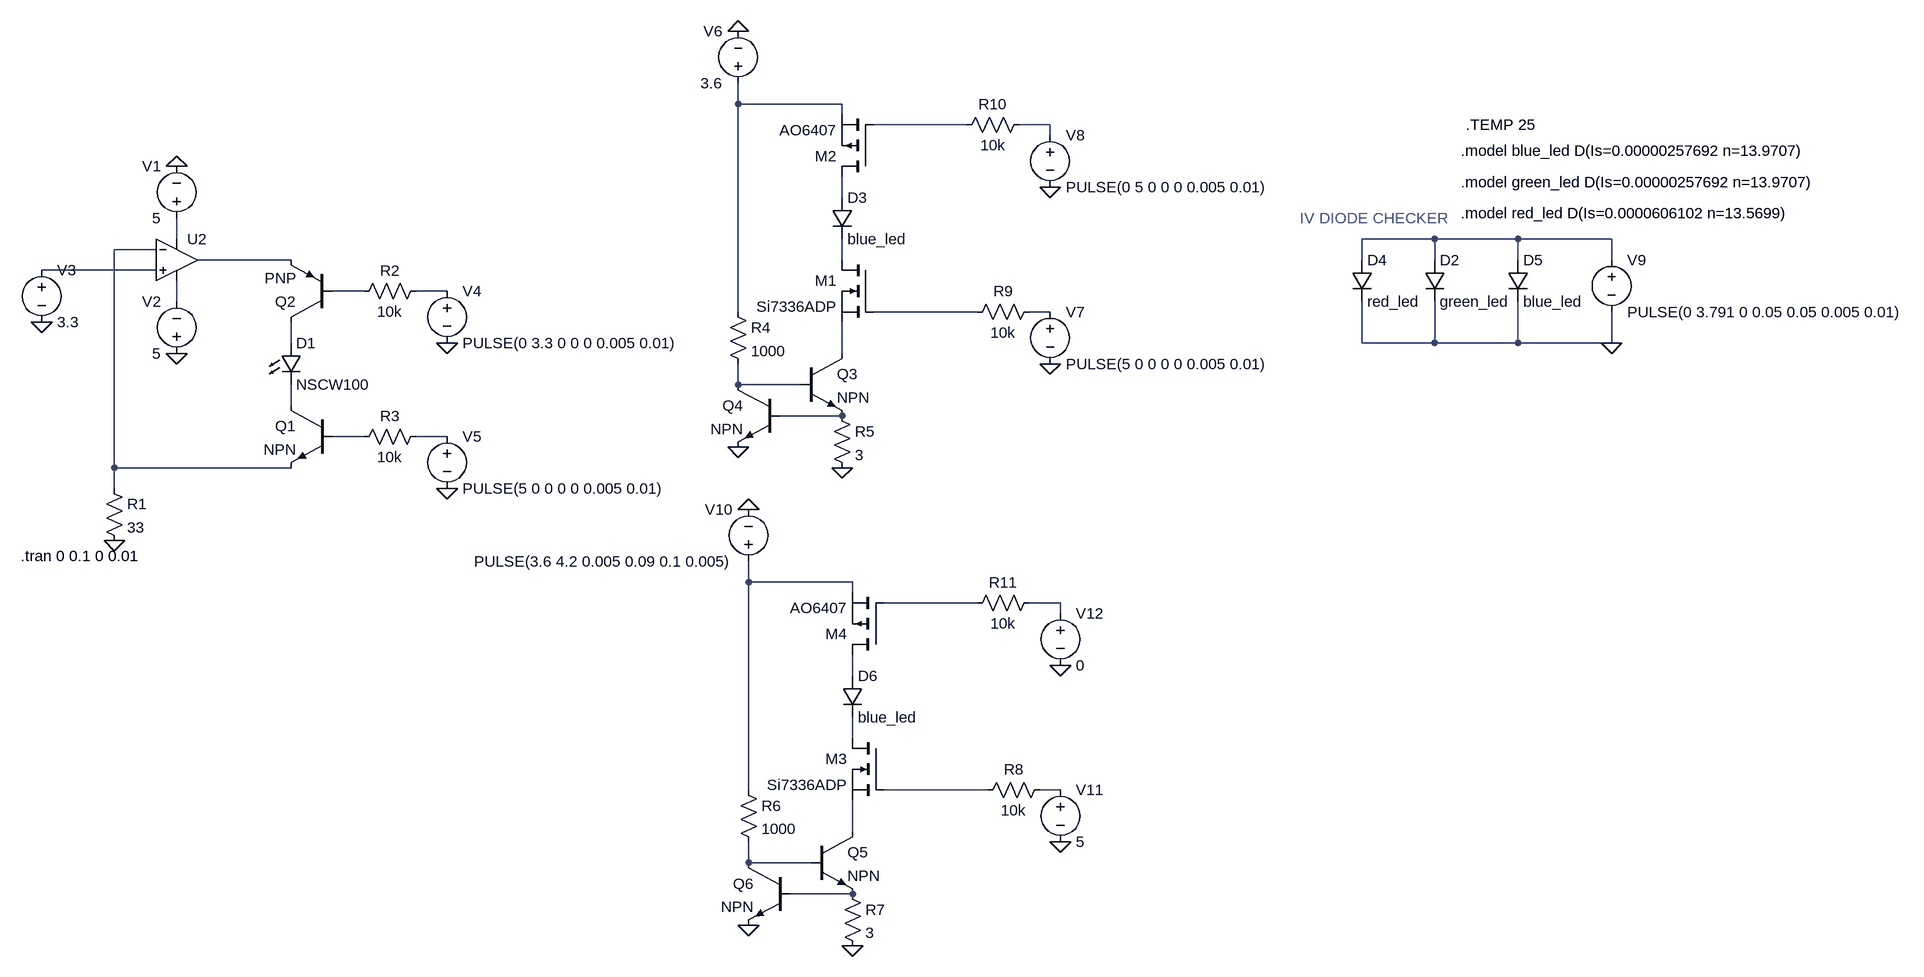
[diagram p0: schematic CC led driver- best I could find.asc]
CC led driver- best I could find.asc, the LTspice schematic file:
Version 4
SHEET 1 2892 1236
WIRE 1072 -80 1072 -112
WIRE 1232 -80 1072 -80
WIRE 1232 -64 1232 -80
WIRE 1424 -48 1280 -48
WIRE 1552 -48 1504 -48
WIRE 1552 -32 1552 -48
WIRE 1232 64 1232 32
WIRE 208 128 208 96
WIRE 2144 128 2032 128
WIRE 2272 128 2144 128
WIRE 2416 128 2272 128
WIRE 176 144 112 144
WIRE 384 160 240 160
WIRE 1232 160 1232 128
WIRE 2032 160 2032 128
WIRE 2144 160 2144 128
WIRE 2272 160 2272 128
WIRE 2416 160 2416 128
WIRE 176 176 0 176
WIRE 496 208 448 208
WIRE 624 208 576 208
WIRE 208 224 208 192
WIRE 1072 240 1072 -80
WIRE 1440 240 1280 240
WIRE 1552 240 1520 240
WIRE 384 288 384 256
WIRE 2032 288 2032 224
WIRE 2144 288 2144 224
WIRE 2144 288 2032 288
WIRE 2272 288 2272 224
WIRE 2272 288 2144 288
WIRE 2416 288 2416 240
WIRE 2416 288 2272 288
WIRE 1232 304 1232 256
WIRE 1072 352 1072 320
WIRE 1168 352 1072 352
WIRE 384 384 384 352
WIRE 1232 400 1136 400
WIRE 496 432 448 432
WIRE 624 432 576 432
WIRE 112 480 112 144
WIRE 384 480 112 480
WIRE 112 512 112 480
WIRE 1088 656 1088 624
WIRE 1248 656 1088 656
WIRE 1248 672 1248 656
WIRE 1440 688 1296 688
WIRE 1568 688 1520 688
WIRE 1568 704 1568 688
WIRE 1248 800 1248 768
WIRE 1248 896 1248 864
WIRE 1088 976 1088 656
WIRE 1456 976 1296 976
WIRE 1568 976 1536 976
WIRE 1248 1040 1248 992
WIRE 1088 1088 1088 1056
WIRE 1184 1088 1088 1088
WIRE 1248 1136 1152 1136
FLAG 208 304 0
FLAG 208 16 0
FLAG 0 256 0
FLAG 112 592 0
FLAG 624 288 0
FLAG 624 512 0
FLAG 1072 448 0
FLAG 1232 480 0
FLAG 1552 320 0
FLAG 1072 -192 0
FLAG 1552 48 0
FLAG 2416 288 0
FLAG 1088 1184 0
FLAG 1248 1216 0
FLAG 1568 1056 0
FLAG 1088 544 0
FLAG 1568 784 0
SYMBOL res 96 496 R0
SYMATTR InstName R1
SYMATTR Value 33
SYMBOL voltage 208 112 R180
WINDOW 0 24 96 Left 2
WINDOW 3 24 16 Left 2
WINDOW 123 0 0 Left 0
WINDOW 39 0 0 Left 0
SYMATTR InstName V1
SYMATTR Value 5
SYMBOL voltage 208 320 R180
WINDOW 0 24 96 Left 2
WINDOW 3 24 16 Left 2
WINDOW 123 0 0 Left 0
WINDOW 39 0 0 Left 0
SYMATTR InstName V2
SYMATTR Value 5
SYMBOL voltage 0 160 R0
WINDOW 123 0 0 Left 0
WINDOW 39 0 0 Left 0
SYMATTR InstName V3
SYMATTR Value 3.3
SYMBOL npn 448 384 M0
SYMATTR InstName Q1
SYMBOL pnp 448 256 R180
SYMATTR InstName Q2
SYMBOL LED 368 288 R0
SYMATTR InstName D1
SYMATTR Value NSCW100
SYMATTR Description Diode
SYMATTR Type diode
SYMBOL voltage 624 192 R0
WINDOW 123 0 0 Left 0
WINDOW 39 0 0 Left 0
SYMATTR InstName V4
SYMATTR Value PULSE(0 3.3 0 0 0 0.005 0.01)
SYMBOL voltage 624 416 R0
WINDOW 123 0 0 Left 0
WINDOW 39 0 0 Left 0
SYMATTR InstName V5
SYMATTR Value PULSE(5 0 0 0 0 0.005 0.01)
SYMBOL Opamps\\UniversalOpamp2 208 160 R0
SYMATTR InstName U2
SYMBOL res 592 192 R90
WINDOW 0 0 56 VBottom 2
WINDOW 3 32 56 VTop 2
SYMATTR InstName R2
SYMATTR Value 10k
SYMBOL res 592 416 R90
WINDOW 0 0 56 VBottom 2
WINDOW 3 32 56 VTop 2
SYMATTR InstName R3
SYMATTR Value 10k
SYMBOL npn 1168 304 R0
SYMATTR InstName Q3
SYMBOL npn 1136 352 M0
SYMATTR InstName Q4
SYMBOL res 1056 224 R0
SYMATTR InstName R4
SYMATTR Value 1000
SYMBOL res 1216 384 R0
SYMATTR InstName R5
SYMATTR Value 3
SYMBOL voltage 1072 -96 R180
WINDOW 0 24 96 Left 2
WINDOW 3 24 16 Left 2
WINDOW 123 0 0 Left 0
WINDOW 39 0 0 Left 0
SYMATTR InstName V6
SYMATTR Value 3.6
SYMBOL nmos 1280 160 M0
SYMATTR InstName M1
SYMATTR Value Si7336ADP
SYMBOL voltage 1552 224 R0
WINDOW 123 0 0 Left 0
WINDOW 39 0 0 Left 0
SYMATTR InstName V7
SYMATTR Value PULSE(5 0 0 0 0 0.005 0.01)
SYMBOL pmos 1280 32 R180
SYMATTR InstName M2
SYMATTR Value AO6407
SYMBOL voltage 1552 -48 R0
WINDOW 123 0 0 Left 0
WINDOW 39 0 0 Left 0
SYMATTR InstName V8
SYMATTR Value PULSE(0 5 0 0 0 0.005 0.01)
SYMBOL res 1536 224 R90
WINDOW 0 0 56 VBottom 2
WINDOW 3 32 56 VTop 2
SYMATTR InstName R9
SYMATTR Value 10k
SYMBOL res 1520 -64 R90
WINDOW 0 0 56 VBottom 2
WINDOW 3 32 56 VTop 2
SYMATTR InstName R10
SYMATTR Value 10k
SYMBOL diode 2016 160 R0
SYMATTR InstName D4
SYMATTR Value red_led
SYMBOL voltage 2416 144 R0
WINDOW 123 0 0 Left 0
WINDOW 39 0 0 Left 0
SYMATTR InstName V9
SYMATTR Value PULSE(0 3.791 0 0.05 0.05 0.005 0.01)
SYMBOL diode 2128 160 R0
SYMATTR InstName D2
SYMATTR Value green_led
SYMBOL diode 2256 160 R0
SYMATTR InstName D5
SYMATTR Value blue_led
SYMBOL diode 1216 64 R0
SYMATTR InstName D3
SYMATTR Value blue_led
SYMBOL npn 1184 1040 R0
SYMATTR InstName Q5
SYMBOL npn 1152 1088 M0
SYMATTR InstName Q6
SYMBOL res 1072 960 R0
SYMATTR InstName R6
SYMATTR Value 1000
SYMBOL res 1232 1120 R0
SYMATTR InstName R7
SYMATTR Value 3
SYMBOL voltage 1088 640 R180
WINDOW 0 24 96 Left 2
WINDOW 3 24 16 Left 2
WINDOW 123 0 0 Left 0
WINDOW 39 0 0 Left 0
SYMATTR InstName V10
SYMATTR Value PULSE(3.6 4.2 0.005 0.09 0.1 0.005)
SYMBOL nmos 1296 896 M0
SYMATTR InstName M3
SYMATTR Value Si7336ADP
SYMBOL voltage 1568 960 R0
WINDOW 123 0 0 Left 0
WINDOW 39 0 0 Left 0
SYMATTR InstName V11
SYMATTR Value 5
SYMBOL pmos 1296 768 R180
SYMATTR InstName M4
SYMATTR Value AO6407
SYMBOL voltage 1568 688 R0
WINDOW 123 0 0 Left 0
WINDOW 39 0 0 Left 0
SYMATTR InstName V12
SYMATTR Value 0
SYMBOL res 1552 960 R90
WINDOW 0 0 56 VBottom 2
WINDOW 3 32 56 VTop 2
SYMATTR InstName R8
SYMATTR Value 10k
SYMBOL res 1536 672 R90
WINDOW 0 0 56 VBottom 2
WINDOW 3 32 56 VTop 2
SYMATTR InstName R11
SYMATTR Value 10k
SYMBOL diode 1232 800 R0
SYMATTR InstName D6
SYMATTR Value blue_led
TEXT -32 616 Left 2 !.tran 0 0.1 0 0.01
TEXT 2184 88 Left 2 !.model red_led D(Is=0.0000606102 n=13.5699)
TEXT 2184 40 Left 2 !.model green_led D(Is=0.00000257692 n=13.9707)
TEXT 2184 -8 Left 2 !.model blue_led D(Is=0.00000257692 n=13.9707)
TEXT 1936 96 Left 2 ;IV DIODE CHECKER
TEXT 2192 -48 Left 2 !.TEMP 25

The netlist it stands for:
* CC led driver- best I could find.asc
R1 N007 0 33
V1 N005 0 5
V2 0 N013 5
V3 N010 0 3.3
Q1 N019 N021 N007 0 NPN
Q2 N016 N011 N008 0 PNP
D1 N016 N019 NSCW100
V4 N012 0 PULSE(0 3.3 0 0 0 0.005 0.01)
V5 N022 0 PULSE(5 0 0 0 0 0.005 0.01)
XU2 N010 N007 N005 N013 N008 level.2 Avol=1Meg GBW=10Meg Slew=10Meg ilimit=25m rail=0 Vos=0 phimargin=45 en=0 enk=0 in=0 ink=0 Rin=500Meg  ; pins IN+ IN- V+ V- OUT
R2 N012 N011 10k
R3 N022 N021 10k
Q3 N017 N018 N020 0 NPN
Q4 N018 N020 0 0 NPN
R4 N001 N018 1000
R5 N020 0 3
V6 N001 0 3.6
M1 N009 N014 N017 N017 Si7336ADP
V7 N015 0 PULSE(5 0 0 0 0 0.005 0.01)
M2 N004 N002 N001 N001 AO6407
V8 N003 0 PULSE(0 5 0 0 0 0.005 0.01)
R9 N015 N014 10k
R10 N003 N002 10k
D4 N006 0 red_led
V9 N006 0 PULSE(0 3.791 0 0.05 0.05 0.005 0.01)
D2 N006 0 green_led
D5 N006 0 blue_led
D3 N004 N009 blue_led
Q5 N030 N031 N032 0 NPN
Q6 N031 N032 0 0 NPN
R6 N023 N031 1000
R7 N032 0 3
V10 N023 0 PULSE(3.6 4.2 0.005 0.09 0.1 0.005)
M3 N027 N028 N030 N030 Si7336ADP
V11 N029 0 5
M4 N026 N024 N023 N023 AO6407
V12 N025 0 0
R8 N029 N028 10k
R11 N025 N024 10k
D6 N026 N027 blue_led
.model D D
.lib standard.dio
.model NPN NPN
.model PNP PNP
.lib standard.bjt
.model NMOS NMOS
.model PMOS PMOS
.lib standard.mos
.tran 0 0.1 0 0.01
.model red_led D(Is=0.0000606102 n=13.5699)
.model green_led D(Is=0.00000257692 n=13.9707)
.model blue_led D(Is=0.00000257692 n=13.9707)
* IV DIODE CHECKER
.TEMP 25
.lib UniversalOpamps2.sub
.backanno
.end